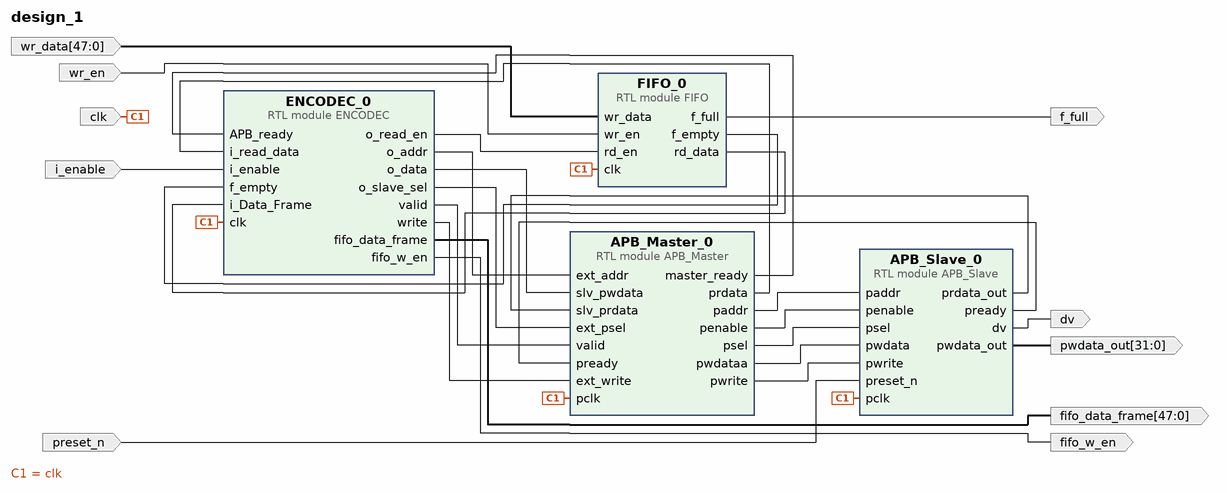
[diagram p0: block diagram of the top level]
# Vivado block design design_1, xc7a100tcsg324-1, Vivado 2023.2
create_bd_design design_1

create_bd_port -dir I clk
create_bd_port -dir I wr_en
create_bd_port -dir I -from 47 -to 0 wr_data
create_bd_port -dir O f_full
create_bd_port -dir I i_enable
create_bd_port -dir O -from 47 -to 0 fifo_data_frame
create_bd_port -dir O fifo_w_en
create_bd_port -dir I preset_n
create_bd_port -dir O -from 31 -to 0 pwdata_out
create_bd_port -dir O dv

create_bd_cell -type module -reference FIFO FIFO_0
create_bd_cell -type module -reference ENCODEC ENCODEC_0
create_bd_cell -type module -reference APB_Master APB_Master_0
create_bd_cell -type module -reference APB_Slave APB_Slave_0

# ---- connections ----

connect_bd_net [get_bd_pins APB_Master_0/master_ready] [get_bd_pins ENCODEC_0/APB_ready]
connect_bd_net [get_bd_pins APB_Master_0/paddr] [get_bd_pins APB_Slave_0/paddr]
connect_bd_net [get_bd_pins APB_Master_0/penable] [get_bd_pins APB_Slave_0/penable]
connect_bd_net [get_bd_pins APB_Master_0/prdata] [get_bd_pins ENCODEC_0/i_read_data]
connect_bd_net [get_bd_pins APB_Master_0/psel] [get_bd_pins APB_Slave_0/psel]
connect_bd_net [get_bd_pins APB_Master_0/pwdataa] [get_bd_pins APB_Slave_0/pwdata]
connect_bd_net [get_bd_pins APB_Master_0/pwrite] [get_bd_pins APB_Slave_0/pwrite]
connect_bd_net [get_bd_pins APB_Slave_0/dv] [get_bd_ports dv]
connect_bd_net [get_bd_pins APB_Slave_0/prdata_out] [get_bd_pins APB_Master_0/slv_prdata]
connect_bd_net [get_bd_pins APB_Slave_0/pready] [get_bd_pins APB_Master_0/pready]
connect_bd_net [get_bd_pins APB_Slave_0/pwdata_out] [get_bd_ports pwdata_out]
connect_bd_net [get_bd_pins ENCODEC_0/fifo_data_frame] [get_bd_ports fifo_data_frame]
connect_bd_net [get_bd_pins ENCODEC_0/fifo_w_en] [get_bd_ports fifo_w_en]
connect_bd_net [get_bd_pins ENCODEC_0/o_addr] [get_bd_pins APB_Master_0/ext_addr]
connect_bd_net [get_bd_pins ENCODEC_0/o_data] [get_bd_pins APB_Master_0/slv_pwdata]
connect_bd_net [get_bd_pins ENCODEC_0/o_read_en] [get_bd_pins FIFO_0/rd_en]
connect_bd_net [get_bd_pins ENCODEC_0/o_slave_sel] [get_bd_pins APB_Master_0/ext_psel]
connect_bd_net [get_bd_pins ENCODEC_0/valid] [get_bd_pins APB_Master_0/valid]
connect_bd_net [get_bd_pins ENCODEC_0/write] [get_bd_pins APB_Master_0/ext_write]
connect_bd_net [get_bd_pins FIFO_0/f_empty] [get_bd_pins ENCODEC_0/f_empty]
connect_bd_net [get_bd_pins FIFO_0/f_full] [get_bd_ports f_full]
connect_bd_net [get_bd_pins FIFO_0/rd_data] [get_bd_pins ENCODEC_0/i_Data_Frame]
connect_bd_net [get_bd_ports clk] [get_bd_pins FIFO_0/clk] [get_bd_pins ENCODEC_0/clk] [get_bd_pins APB_Slave_0/pclk] [get_bd_pins APB_Master_0/pclk]
connect_bd_net [get_bd_ports i_enable] [get_bd_pins ENCODEC_0/i_enable]
connect_bd_net [get_bd_ports preset_n] [get_bd_pins APB_Slave_0/preset_n]
connect_bd_net [get_bd_ports wr_data] [get_bd_pins FIFO_0/wr_data]
connect_bd_net [get_bd_ports wr_en] [get_bd_pins FIFO_0/wr_en]

validate_bd_design
save_bd_design
